# EAGLE schematic imu (EAGLE 5.11)
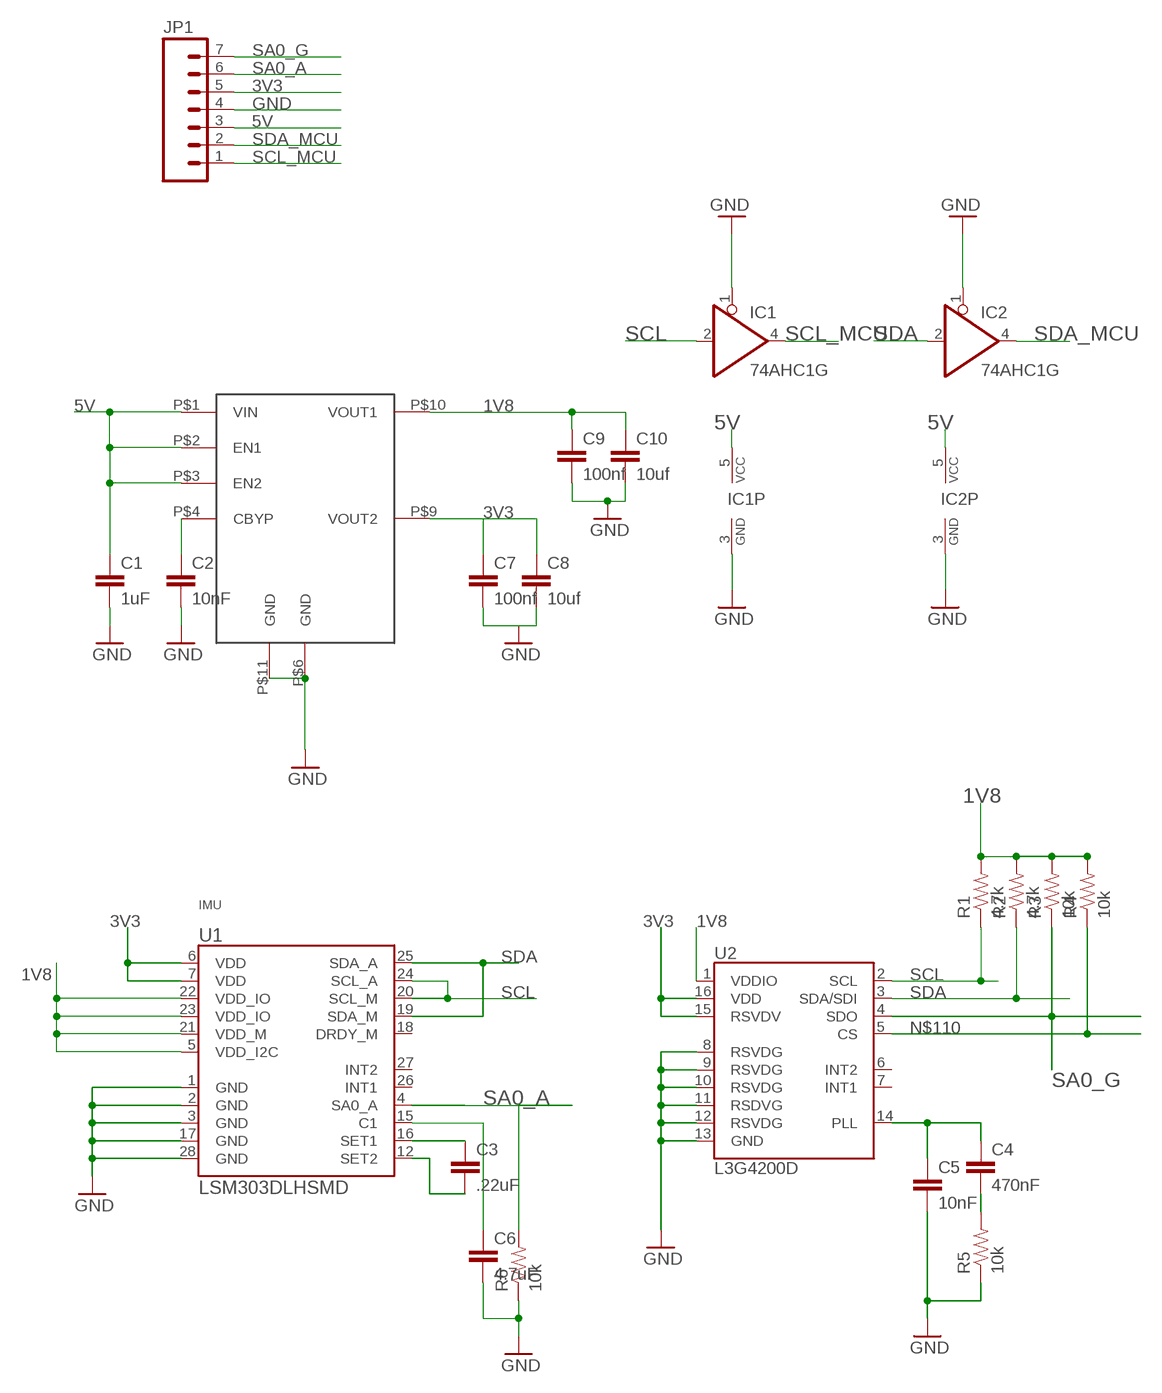
[diagram p0: schematic, sheet 1]

## Parts
C1  1uF  CAP0805  [0805]
C2  10nF  CAP0805  [0805]
C3  .22uF  CAP0805  [0805]
C4  470nF  CAP0805  [0805]
C5  10nF  CAP0805  [0805]
C6  4.7uF  CAP0805  [0805]
C7  100nf  CAP0805  [0805]
C8  10uf  CAP0805  [0805]
C9  100nf  CAP0805  [0805]
C10  10uf  CAP0805  [0805]
IC1  74AHC1G  74XX-LITTLE-DE_74AHC1G125DCK  [74XX-LITTLE-DE_SC70-5]
IC2  74AHC1G  74XX-LITTLE-DE_74AHC1G125DCK  [74XX-LITTLE-DE_SC70-5]
JP1  M07  [1X07]
R1  4.7k  RESISTOR0805-RES  [0805]
R2  4.7k  RESISTOR0805-RES  [0805]
R3  10k  RESISTOR0805-RES  [0805]
R4  10k  RESISTOR0805-RES  [0805]
R5  10k  RESISTOR0805-RES  [0805]
R6  10k  RESISTOR0805-RES  [0805]
U1  LSM303DLHSMD  [LGA28-5X5]
U2  L3G4200D  [LGA16-4X4]
U$1  LP5996  [LLP-10]

## Nets
1V8: C9.1 C10.1 R1.2 R2.2 R3.2 R4.2 U1.5(VDD_I2C) U1.21(VDD_M) U1.22(VDD_IO) U1.23(VDD_IO) U2.1(VDDIO) U$1.P$10(VOUT1)
3V3: C7.1 C8.1 JP1.5 U1.6(VDD) U1.7(VDD) U2.15(RSVDV) U2.16(VDD) U$1.P$9(VOUT2)
5V: C1.1 IC1.5(VCC) IC2.5(VCC) JP1.3 U$1.P$1(VIN) U$1.P$2(EN1) U$1.P$3(EN2)
GND: C1.2 C2.2 C5.2 C6.2 C7.2 C8.2 C9.2 C10.2 IC1.1(OE) IC1.3(GND) IC2.1(OE) IC2.3(GND) JP1.4 R5.1 R6.1 U1.1(GND) U1.2(GND) U1.3(GND) U1.17(GND) U1.28(GND) U2.8(RSVDG) U2.9(RSVDG) U2.10(RSVDG) U2.11(RSDVG) U2.12(RSVDG) U2.13(GND) U$1.P$6(GND) U$1.P$11(GND)
N$1: C6.1 U1.15(C1)
N$97: C3.1 U1.16(SET1)
N$98: C3.2 U1.12(SET2)
N$102: C4.1 C5.1 U2.14(PLL)
N$103: C4.2 R5.2
N$109: C2.1 U$1.P$4(CBYP)
N$110: R4.1 U2.5(CS)
SA0_A: JP1.6 R6.2 U1.4(SA0_A)
SA0_G: JP1.7 R3.1 U2.4(SDO)
SCL: IC1.2(I) R1.1 U1.20(SCL_M) U1.24(SCL_A) U2.2(SCL)
SCL_MCU: IC1.4(O) JP1.1
SDA: IC2.2(I) R2.1 U1.19(SDA_M) U1.25(SDA_A) U2.3(SDA/SDI)
SDA_MCU: IC2.4(O) JP1.2
Unconnected: U1.18(DRDY_M) U1.26(INT1) U1.27(INT2) U2.6(INT2) U2.7(INT1)

## Notes on the sheet
- IMU

## Library data of the parts
C1-C10 = SparkFun:CAP: Capacitor Standard 0603 ceramic capacitor, and 0.1" leaded capacitor.
IC1 IC2 = avrcanbus:74XX-LITTLE-DE_74*1G125: Single Bus Buffer Gate with 3-State Output
JP1 = SparkFun:M07: Header 7 Standard 7-pin 0.1" header. Use with straight break away headers (SKU : PRT-00116), right angle break away headers (PRT-00553), swiss pins (PRT-00743), machine pins (PRT-00117), and female headers (PRT-00115). NOTES ON THE VARIANTS LOCK and LOCK_LONGPADS... This footprint was designed to help hold the alignment of a through-hole component (i.e. 7-pin header) while soldering it into place. You may notice that each hole has been shifted either up or down by 0.005 of an inch from it's more standard position (which is usually a perfectly straight line). This slight alteration caused the pins (the squares in the middle) to touch the edges of the holes. Because they are alternating, it causes a "brace" to hold the header in place. 0.005 has proven to be the perfect amount of "off-center" position when using our standard breakaway headers. Although looks a little odd when you look at the bare footprint, once you have a header in there, the alteration is very hard to notice. Also, if you push a header all the way into place, it is covered up entirely on the bottom side. This idea of altering the position of holes to aid alignment will be further integrated into the Sparkfun Library for other footprints. It can help hold any component with 3 or more connection pins.
R1-R6 = SparkFun:RESISTOR: Resistor Basic schematic elements and footprints for 0603, 1206, and PTH resistors.
U1 = imu:LSM303DLH
U2 = SparkFun:L3G4200D: L3G4200D Three-axis, digital output gyroscope The L3G4200D is a low-power three-axis angular rate sensor, has a full scale of ±250/±500/±2000 dps and is capable of measuring rates with a user-selectable bandwidth. It includes a sensing element and an IC interface capable of providing the measured angular rate to the external world through a digital interface (I2C/SPI). Package: 4x4x1.1 LGA-16 (LGA16-4x4.PAC)
U$1 = pcbqr:LP5996

## Net classes
1 power: width 0.406 mm